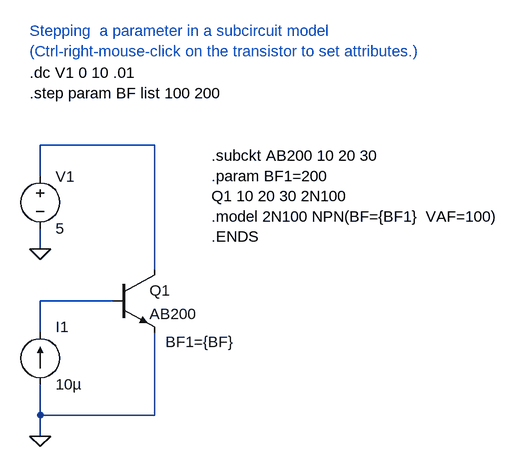
[diagram p0: schematic Step_subckt_transistor_param.asc]
Step_subckt_transistor_param.asc, the LTspice schematic file:
Version 4
SHEET 1 880 680
WIRE 240 -96 64 -96
WIRE 64 -48 64 -96
WIRE 64 64 64 32
WIRE 240 96 240 -96
WIRE 176 144 64 144
WIRE 64 192 64 144
WIRE 64 320 64 272
WIRE 240 320 240 192
WIRE 240 320 64 320
WIRE 64 352 64 320
FLAG 64 64 0
FLAG 64 352 0
SYMBOL npn 176 96 R0
WINDOW 39 81 111 Left 0
SYMATTR InstName Q1
SYMATTR Value AB200
SYMATTR Prefix X
SYMATTR SpiceLine BF1={BF}
SYMBOL voltage 64 -64 R0
SYMATTR InstName V1
SYMATTR Value 5
SYMBOL current 64 272 M180
WINDOW 0 24 88 Left 0
WINDOW 3 24 0 Left 0
SYMATTR InstName I1
SYMATTR Value 10µ
TEXT 328 -80 Left 0 !.subckt AB200 10 20 30\n.param BF1=200\nQ1 10 20 30 2N100 \n.model 2N100 NPN(BF={BF1}  VAF=100)\n.ENDS
TEXT 48 -176 Left 0 !.step param BF list 100 200
TEXT 48 -208 Left 0 !.dc V1 0 10 .01
TEXT 48 -272 Left 0 ;Stepping  a parameter in a subcircuit model\n(Ctrl-right-mouse-click on the transistor to set attributes.)

The netlist it stands for:
* Step_subckt_transistor_param.asc
XQ1 N001 N002 0 AB200 BF1={BF}  ; pins C B E
V1 N001 0 5
I1 0 N002 10µ
.subckt AB200 10 20 30
.param BF1=200
Q1 10 20 30 2N100
.model 2N100 NPN(BF={BF1}  VAF=100)
.ENDS
.step param BF list 100 200
.dc V1 0 10 .01
* Stepping  a parameter in a subcircuit model
* (Ctrl-right-mouse-click on the transistor to set attributes.)
.backanno
.end